# Altium schematic sheet Server_CPU_IO.SchDoc
size D
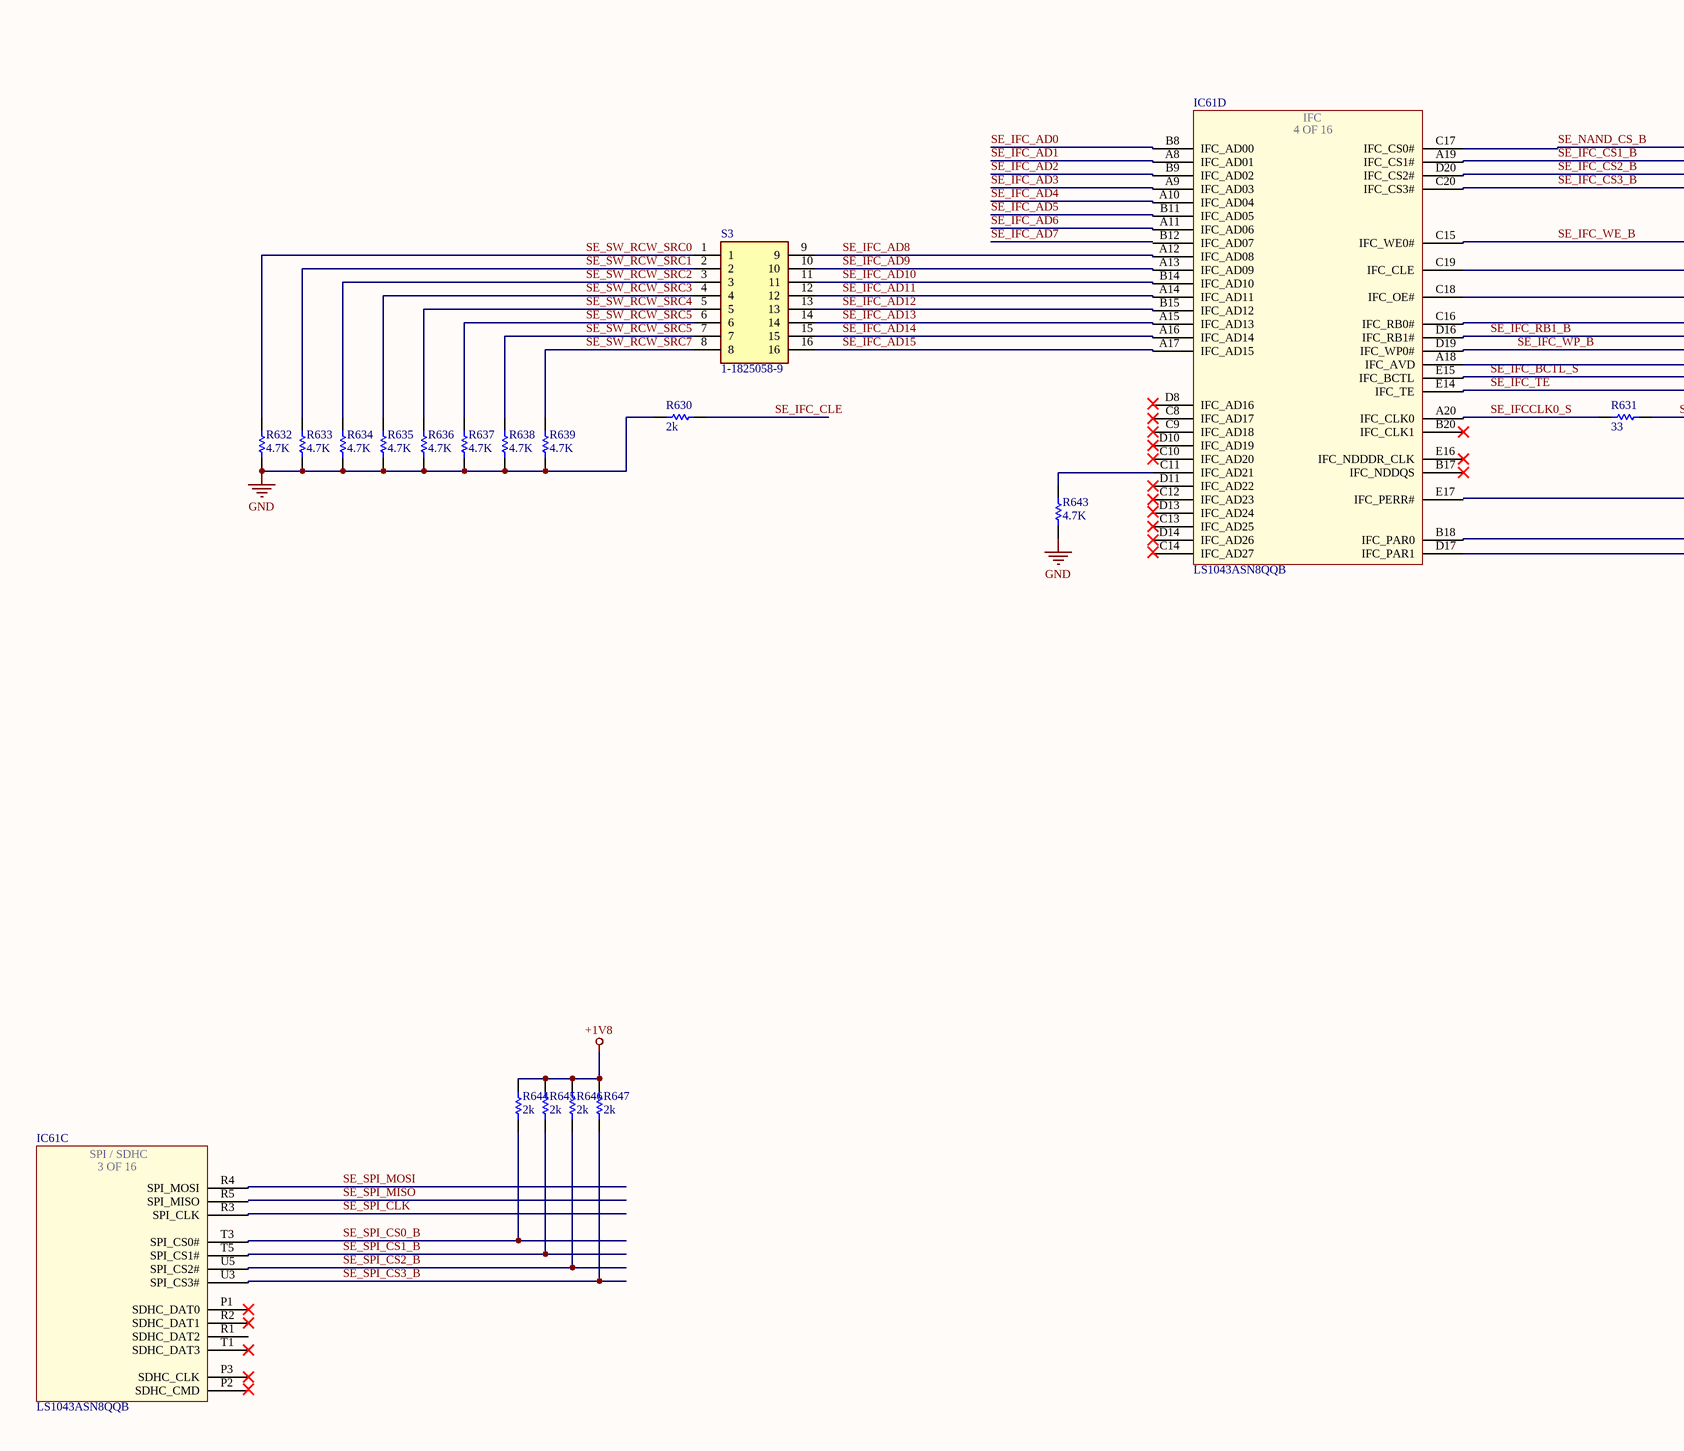
[diagram p0: Server_CPU_IO.SchDoc, left]
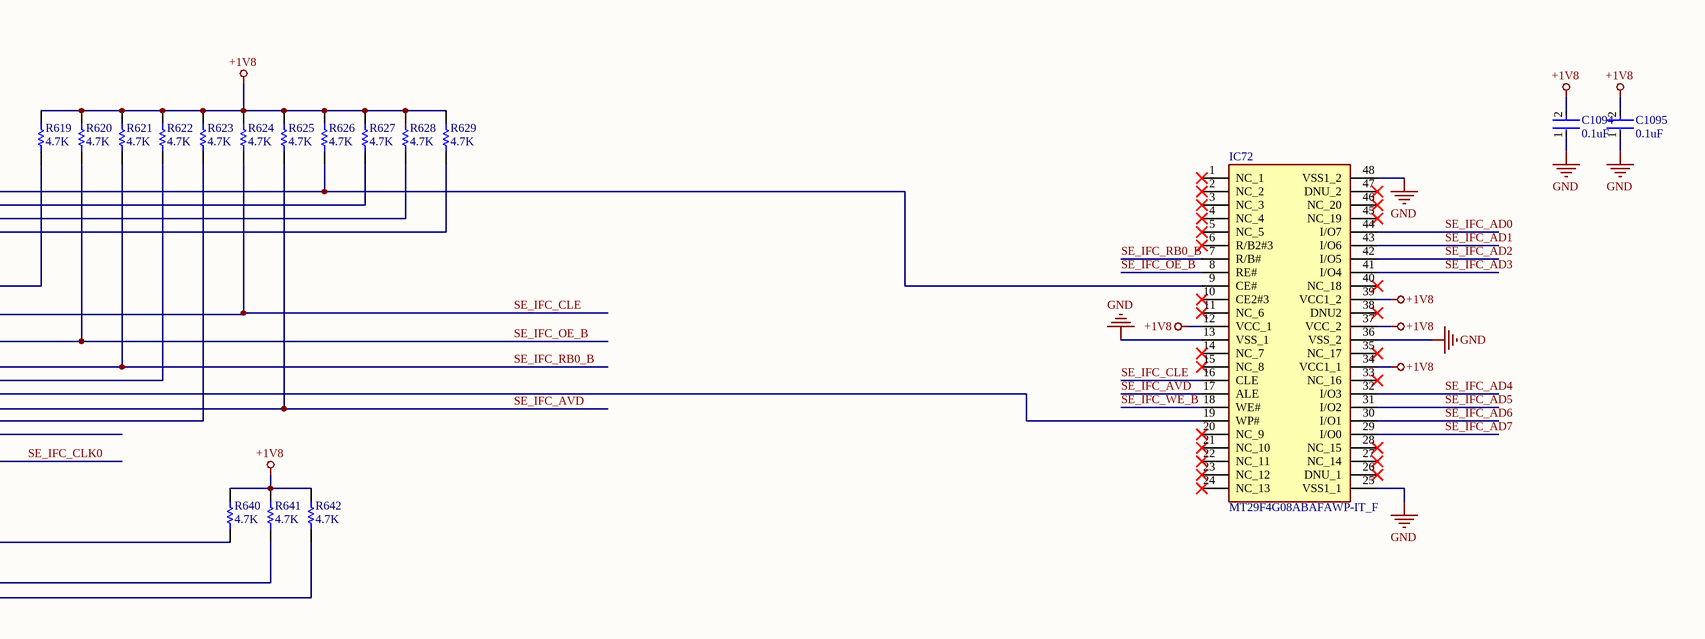
[diagram p1: Server_CPU_IO.SchDoc, right]

## Parts
C1094  0.1uF  [FP-GRM15-MFG]
C1095  0.1uF  [FP-GRM15-MFG]
IC61  LS1043ASN8QQB  [BGA780C80P28X28_2300X2300X261]  (parts C,D of 16)
IC72  MT29F4G08ABAFAWP-IT_F  [SOP50P2000X120-48N]
R619  4.7K  [RESC1005X40X25LL05T05]
R620  4.7K  [RESC1005X40X25LL05T05]
R621  4.7K  [RESC1005X40X25LL05T05]
R622  4.7K  [RESC1005X40X25LL05T05]
R623  4.7K  [RESC1005X40X25LL05T05]
R624  4.7K  [RESC1005X40X25LL05T05]
R625  4.7K  [RESC1005X40X25LL05T05]
R626  4.7K  [RESC1005X40X25LL05T05]
R627  4.7K  [RESC1005X40X25LL05T05]
R628  4.7K  [RESC1005X40X25LL05T05]
R629  4.7K  [RESC1005X40X25LL05T05]
R630  2k  [RESC1005X40X25NL05T05]
R631  33  [RESC1005X40X25LL05T05]
R632  4.7K  [RESC1005X40X25LL05T05]
R633  4.7K  [RESC1005X40X25LL05T05]
R634  4.7K  [RESC1005X40X25LL05T05]
R635  4.7K  [RESC1005X40X25LL05T05]
R636  4.7K  [RESC1005X40X25LL05T05]
R637  4.7K  [RESC1005X40X25LL05T05]
R638  4.7K  [RESC1005X40X25LL05T05]
R639  4.7K  [RESC1005X40X25LL05T05]
R640  4.7K  [RESC1005X40X25LL05T05]
R641  4.7K  [RESC1005X40X25LL05T05]
R642  4.7K  [RESC1005X40X25LL05T05]
R643  4.7K  [RESC1005X40X25LL05T05]
R644  2k  [RESC1005X40X25NL05T05]
R645  2k  [RESC1005X40X25NL05T05]
R646  2k  [RESC1005X40X25NL05T05]
R647  2k  [RESC1005X40X25NL05T05]
S3  1-1825058-9  [118250589]

## Nets
+1V8: C1094.2 C1095.2 IC72.12(VCC_1) IC72.34(VCC1_1) IC72.37(VCC_2) IC72.39(VCC1_2) R619.2 R620.2 R621.2 R622.2 R623.2 R624.2 R625.2 R626.2 R627.2 R628.2 R629.2 R640.2 R641.2 R642.2 R644.1 R645.1 R646.1 R647.1
GND: C1094.1 C1095.1 IC72.13(VSS_1) IC72.25(VSS1_1) IC72.36(VSS_2) IC72.48(VSS1_2) R630.2 R632.1 R633.1 R634.1 R635.1 R636.1 R637.1 R638.1 R639.1 R643.1
SE_IFC_AD0: IC61.B8(IFC_AD00) IC72.44(I/O7)
SE_IFC_AD1: IC61.A8(IFC_AD01) IC72.43(I/O6)
SE_IFC_AD2: IC61.B9(IFC_AD02) IC72.42(I/O5)
SE_IFC_AD3: IC61.A9(IFC_AD03) IC72.41(I/O4)
SE_IFC_AD4: IC61.A10(IFC_AD04) IC72.32(I/O3)
SE_IFC_AD5: IC61.B11(IFC_AD05) IC72.31(I/O2)
SE_IFC_AD6: IC61.A11(IFC_AD06) IC72.30(I/O1)
SE_IFC_AD7: IC72.29(I/O0)
SE_IFC_AD8: IC61.A12(IFC_AD08) S3.9
SE_IFC_AD9: IC61.A13(IFC_AD09) S3.10
SE_IFC_AD10: IC61.B14(IFC_AD10) S3.11
SE_IFC_AD11: IC61.A14(IFC_AD11) S3.12
SE_IFC_AD12: IC61.B15(IFC_AD12) S3.13
SE_IFC_AD13: IC61.A15(IFC_AD13) S3.14
SE_IFC_AD14: IC61.A16(IFC_AD14) S3.15
SE_IFC_AD15: IC61.A17(IFC_AD15) S3.16
SE_IFC_AVD: IC61.A18(IFC_AVD) IC72.17(ALE) R625.1
SE_IFC_BCTL_S: IC61.E15(IFC_BCTL) R623.1
SE_IFC_CLE: IC61.C19(IFC_CLE) IC72.16(CLE) R624.1 R630.1
SE_IFC_CLK0: R631.2
SE_IFC_CS1_B: IC61.A19(IFC_CS1#) R627.1
SE_IFC_CS2_B: IC61.D20(IFC_CS2#) R628.1
SE_IFC_CS3_B: IC61.C20(IFC_CS3#) R629.1
SE_IFC_OE_B: IC61.C18(IFC_OE#) IC72.8(RE#) R620.1
SE_IFC_RB0_B: IC61.C16(IFC_RB0#) IC72.7(R/B#) R621.1
SE_IFC_RB1_B: IC61.D16(IFC_RB1#) R622.1
SE_IFC_TE: IC61.E14(IFC_TE)
SE_IFC_WE_B: IC61.C15(IFC_WE0#) IC72.18(WE#) R619.1
SE_IFC_WP_B: IC61.D19(IFC_WP0#) IC72.19(WP#)
SE_IFCCLK0_S: IC61.A20(IFC_CLK0) R631.1
SE_NAND_CS_B: IC61.C17(IFC_CS0#) IC72.9(CE#) R626.1
SE_SPI_CLK: IC61.R3(SPI_CLK)
SE_SPI_CS0_B: IC61.T3(SPI_CS0#) R644.2
SE_SPI_CS1_B: IC61.T5(SPI_CS1#) R645.2
SE_SPI_CS2_B: IC61.U5(SPI_CS2#) R646.2
SE_SPI_CS3_B: IC61.U3(SPI_CS3#) R647.2
SE_SPI_MOSI: IC61.R4(SPI_MOSI)
SE_SW_RCW_SRC0: R632.2 S3.1
SE_SW_RCW_SRC1: R633.2 S3.2
SE_SW_RCW_SRC2: R634.2 S3.3
SE_SW_RCW_SRC3: R635.2 S3.4
SE_SW_RCW_SRC4: R636.2 S3.5
SE_SW_RCW_SRC5: R637.2 R638.2 S3.6 S3.7
SE_SW_RCW_SRC7: R639.2 S3.8
NetIC61_B18: IC61.B18(IFC_PAR0) R641.1
NetIC61_C11: IC61.C11(IFC_AD21) R643.2
NetIC61_D17: IC61.D17(IFC_PAR1) R642.1

Not connected (* = marked no-connect by the designer): IC61 B12(IFC_AD07) B17(IFC_NDDQS)* B20(IFC_CLK1)* C8(IFC_AD17)* C9(IFC_AD18)* C10(IFC_AD20)* C12(IFC_AD23)* C13(IFC_AD25)* C14(IFC_AD27) D8(IFC_AD16) D10(IFC_AD19)* D11(IFC_AD22)* D13(IFC_AD24) D14(IFC_AD26)* E16(IFC_NDDDR_CLK)* E17(IFC_PERR#) P1(SDHC_DAT0)* P2(SDHC_CMD) P3(SDHC_CLK)* R1(SDHC_DAT2) R2(SDHC_DAT1)* R5(SPI_MISO) T1(SDHC_DAT3)*; IC72 1(NC_1)* 2(NC_2)* 3(NC_3)* 4(NC_4)* 5(NC_5)* 6(R/B2#3)* 10(CE2#3)* 11(NC_6)* 14(NC_7)* 15(NC_8)* 20(NC_9)* 21(NC_10)* 22(NC_11)* 23(NC_12)* 24(NC_13)* 26(DNU_1)* 27(NC_14)* 28(NC_15)* 33(NC_16)* 35(NC_17)* 38(DNU2)* 40(NC_18)* 45(NC_19)* 46(NC_20)* 47(DNU_2)*; R640 1

## Notes on the sheet
- Title
- Size:
- Date:
- File:
- D
- Number:
- Time:
- Revision:
- Sheet
- of
- (in symbol LS1043ASN8QQB, part C) SPI / SDHC; 3 OF 16
- (in symbol LS1043ASN8QQB, part D) IFC; 4 OF 16

## Library data of the parts
C1094 C1095 = CMP-2100-03641-2: CAP CER 0.1UF 16V X7R 0402; Manufacturer Part Number: GRM155R71C104KA88D; Manufacturer: Murata; Standoff Height: 0mm; Tolerance: 10%; Voltage Rating: 16Vdc; Material: Ceramic; Capacitance: 0.10μF; Value: 0.10μF; RoHS: TRUE; Temperature Characteristic: X7R; Octopart: https://octopart.com/grm155r71c104ka88d-murata-196880; Digikey Description: CAP CER 0.1UF 16V X7R 0402; Device Class L3: Ceramic Capacitors; Height: 0.55mm; ComponentLink2Description: Datasheet; Temperature Range Low: -55°C; Ipc Land Pattern Name: CAPC10050X219; ComponentLink2URL: https://search.murata.co.jp/Ceramy/image/img/A01X/G101/ENG/GRM155R71H471KA01-01A.pdf; Device Class L1: Passive Components; Lead Free: yes; Category: Cap; Package: GRM15; Temperature: -55°C to +125°C; Device Class L2: Capacitors; Temperature Range High: +125°C; Mouser Description: 0402 0.1 uF 16V ±10 % Tolerance X7R SMT Multilayer Ceramic Capacitor
IC61 = LS1043ASN8QQB: Integrated Circuit; Manufacturer_Name: NXP; Datasheet Link: http://www.nxp.com/secured/assets/documents/en/data-sheet/LS1088A.pdf; Height: 2.61mm; Manufacturer_Part_Number: LS1043ASN8QQB; Mouser Part Number: 771-LS1043ASN8QQB; Mouser Price/Stock: https://www.mouser.co.uk/ProductDetail/NXP-Semiconductors/LS1043ASN8QQB/?qs=AQlKX63v8RsTATOTx7X0Jg%3D%3D
IC72 = MT29F4G08ABAFAWP-IT_F: Integrated Circuit; Manufacturer_Name: Micron; Manufacturer_Part_Number: MT29F4G08ABAFAWP-IT:F; Datasheet Link: https://componentsearchengine.com/Datasheets/2/MT29F4G08ABAFAWP-IT_F.pdf; Height: 1.2mm; Mouser Part Number: 340-371016-TRAY; Mouser Price/Stock: https://www.mouser.co.uk/ProductDetail/Micron/MT29F4G08ABAFAWP-ITF/?qs=0lSvoLzn4L9J4k7jmg5qkQ%3D%3D; Arrow Part Number: MT29F4G08ABAFAWP-IT:F; Arrow Price/Stock: https://www.arrow.com/en/products/mt29f4g08abafawp-itf/micron-technology
R619-R629 R632-R643 = CMP-2002-01154-4: Chip Resistor, 4.7 KOhm, +/- 1%, 0.1 W, -55 to 155 degC, 0402 (1005 Metric), RoHS, Tape and Reel; PartNumber: ERJ-2RKF4701X; Voltage Rating: 50 V; Case\/Package: 0402; Power Rating: 100 mW; Height: 0.35 mm; Mounting Technology: Surface Mount; REACH SVHC: Yes; Resistance: 4.7 KOhm; Max Operating Temperature: 155 degC; ComponentLink1Description: Manufacturer URL; ComponentLink2Description: Datasheet; Pins: 2; PackageReference: 0402; Tolerance: 1%; Case Code (Imperial): 0402; Length: 1 mm; PackageDescription: 2-Pin Surface Mount Device, Body 1 x 0.5 mm; RoHSCompliant: true; Package Quantity: 1; Radiation Hardening: No; DatasheetVersion: 04/2015; Width: 0.5 mm; Case Code (Metric): 1005; Mount: Surface Mount; ComponentLink1URL: http://www.panasonic.com/; Min Operating Temperature: -55 degC; Packaging: Cut Tape; ComponentLink2URL: http://industrial.panasonic.com/cdbs/www-data/pdf/RDA0000/AOA0000C86.pdf
R630 R644-R647 = CMP-2002-00758-3: Chip Resistor, 2 KOhm, +/- 1%, 100 mW, -55 to 155 degC, 0402 (1005 Metric), RoHS, Tape and Reel; Manufacturer: Basic Passives; PartNumber: ERJ-2RKF2001X; Power Rating: 100 mW; Voltage Rating: 50 V; Case\/Package: 0402; Resistance: 2 KOhm; Packaging: Tape and Reel; Tolerance: 1%; PackageReference: 0402; Package Quantity: 10000; ComponentLink1URL: http://www.panasonic.com/; Min Operating Temperature: -55 degC; DatasheetVersion: 04/2015; Case Code (Imperial): 0402; PackageDescription: 2-Pin Surface Mount Device, Body 1 x 0.5 mm; Height: 0.35 mm; Pins: 2; Mount: Surface Mount; Radiation Hardening: No; ComponentLink1Description: Manufacturer URL; ComponentLink2Description: Datasheet; Max Operating Temperature: 155 degC; Case Code (Metric): 1005; Length: 1 mm; RoHSCompliant: true; Mounting Technology: Surface Mount; Width: 0.5 mm; ComponentLink2URL: http://industrial.panasonic.com/cdbs/www-data/pdf/RDA0000/AOA0000C86.pdf; REACH SVHC: Unknown
R631 = CMP-2002-01146-1: Manufacturer: Panasonic; Part Number: ERJ2RKF33R0X
S3 = 1-1825058-9: Switch; Manufacturer_Name: TE Connectivity; Datasheet Link: http://www.te.com/commerce/DocumentDelivery/DDEController?Action=showdoc&DocId=Customer+Drawing%7F1825058%7FS4%7Fpdf%7FEnglish%7FENG_CD_1825058_S4.pdf%7F1-1825058-9; Height: 3mm; Manufacturer_Part_Number: 1-1825058-9; Arrow Part Number: 1-1825058-9; Arrow Price/Stock: https://www.arrow.com/en/products/1-1825058-9/te-connectivity